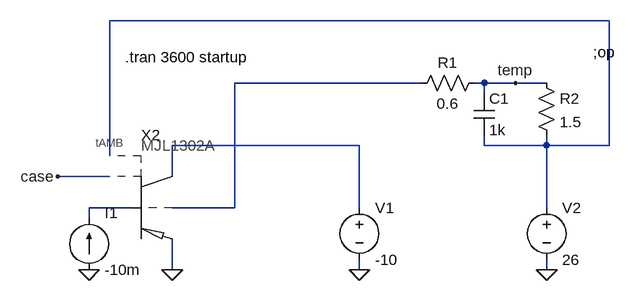
[diagram p0: schematic tb_op.asc]
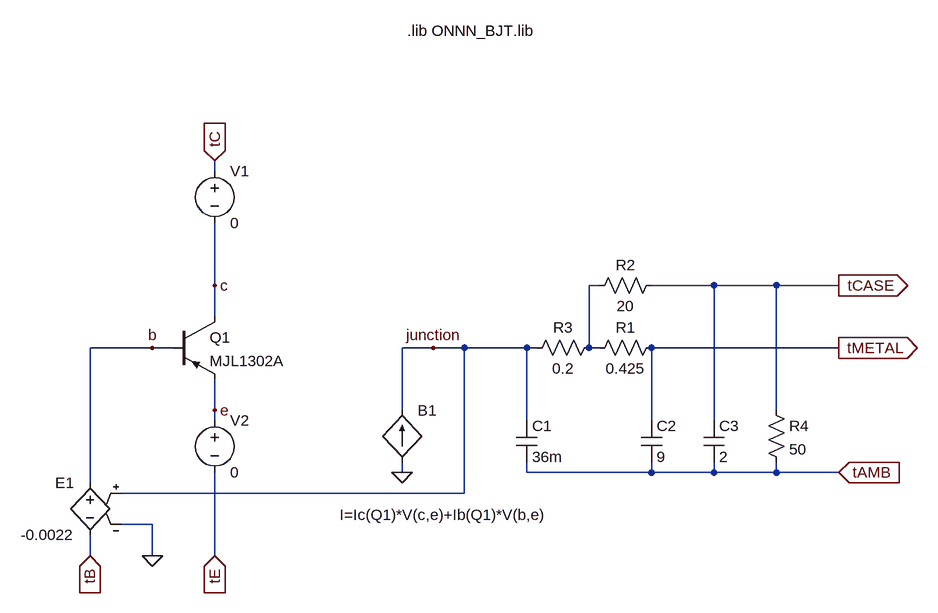
[diagram p1: sub-circuit mjl1302a_therm2p.asc]
tb_op.asc, the LTspice schematic file:
Version 4
SHEET 1 1016 680
WIRE 960 -160 192 -160
WIRE 672 -64 384 -64
WIRE 768 -64 752 -64
WIRE 816 -64 768 -64
WIRE 864 -64 816 -64
WIRE 768 -48 768 -64
WIRE 576 32 288 32
WIRE 768 32 768 16
WIRE 864 32 864 16
WIRE 864 32 768 32
WIRE 960 32 960 -160
WIRE 960 32 864 32
WIRE 192 48 192 -160
WIRE 192 80 112 80
WIRE 288 80 288 32
WIRE 224 128 160 128
WIRE 384 128 384 -64
WIRE 384 128 288 128
WIRE 576 128 576 32
WIRE 864 128 864 32
WIRE 160 144 160 128
WIRE 288 224 288 176
WIRE 576 224 576 208
WIRE 864 224 864 208
FLAG 816 -64 temp
FLAG 576 224 0
FLAG 288 224 0
FLAG 160 224 0
FLAG 864 224 0
FLAG 112 80 case
SYMBOL voltage 576 112 R0
WINDOW 123 0 0 Left 0
WINDOW 39 0 0 Left 0
SYMATTR InstName V1
SYMATTR Value -10
SYMBOL cap 752 -48 R0
SYMATTR InstName C1
SYMATTR Value 1k
SYMBOL res 768 -80 R90
WINDOW 0 0 56 VBottom 0
WINDOW 3 32 56 VTop 0
SYMATTR InstName R1
SYMATTR Value 0.6
SYMBOL res 848 -80 R0
SYMATTR InstName R2
SYMATTR Value 1.5
SYMBOL current 160 224 M180
WINDOW 0 24 88 Left 0
WINDOW 3 24 0 Left 0
WINDOW 123 0 0 Left 0
WINDOW 39 0 0 Left 0
SYMATTR InstName I1
SYMATTR Value -10m
SYMBOL voltage 864 112 R0
WINDOW 123 0 0 Left 0
WINDOW 39 0 0 Left 0
SYMATTR InstName V2
SYMATTR Value 26
SYMBOL MJL1302A_therm2P 272 128 R0
SYMATTR InstName X2
TEXT 936 -112 Left 0 !;op
TEXT 216 -104 Left 0 !.tran 3600 startup

mjl1302a_therm2p.asc, the sub-circuit schematic file:
Version 4
SHEET 1 1244 680
WIRE 128 -240 128 -256
WIRE 128 -64 128 -160
WIRE 720 -64 704 -64
WIRE 896 -64 800 -64
WIRE 992 -64 896 -64
WIRE 1088 -64 992 -64
WIRE 128 -16 128 -64
WIRE 32 32 -64 32
WIRE 64 32 32 32
WIRE 464 32 416 32
WIRE 512 32 464 32
WIRE 608 32 512 32
WIRE 624 32 608 32
WIRE 704 32 704 -64
WIRE 720 32 704 32
WIRE 1088 32 800 32
WIRE 128 128 128 80
WIRE 416 128 416 32
WIRE 992 128 992 -64
WIRE 128 144 128 128
WIRE 608 144 608 32
WIRE 800 144 800 32
WIRE 896 144 896 -64
WIRE 416 224 416 208
WIRE 608 224 608 208
WIRE 800 224 800 208
WIRE 800 224 608 224
WIRE 896 224 896 208
WIRE 896 224 800 224
WIRE 992 224 992 208
WIRE 992 224 896 224
WIRE 1088 224 992 224
WIRE -64 240 -64 32
WIRE 512 256 512 32
WIRE 512 256 -16 256
WIRE 32 304 -16 304
WIRE -64 352 -64 320
WIRE 32 352 32 304
WIRE 128 352 128 224
FLAG 416 224 0
FLAG 128 -64 c
FLAG 32 32 b
FLAG 128 128 e
FLAG 128 -256 tC
IOPIN 128 -256 In
FLAG 464 32 junction
FLAG -64 352 tB
IOPIN -64 352 In
FLAG 32 352 0
FLAG 128 352 tE
IOPIN 128 352 In
FLAG 1088 32 tMETAL
IOPIN 1088 32 Out
FLAG 1088 -64 tCASE
IOPIN 1088 -64 Out
FLAG 1088 224 tAMB
IOPIN 1088 224 In
SYMBOL bi2 416 128 R0
WINDOW 3 -96 161 Left 0
SYMATTR Value I=Ic(Q1)*V(c,e)+Ib(Q1)*V(b,e)
SYMATTR InstName B1
SYMBOL voltage 128 -256 R0
WINDOW 123 0 0 Left 0
WINDOW 39 0 0 Left 0
SYMATTR InstName V1
SYMATTR Value 0
SYMBOL e -64 224 M0
SYMATTR InstName E1
SYMATTR Value -0.0022
SYMBOL voltage 128 128 R0
WINDOW 123 0 0 Left 0
WINDOW 39 0 0 Left 0
SYMATTR InstName V2
SYMATTR Value 0
SYMBOL cap 592 144 R0
SYMATTR InstName C1
SYMATTR Value 36m
SYMBOL res 816 16 R90
WINDOW 0 0 56 VBottom 0
WINDOW 3 32 56 VTop 0
SYMATTR InstName R1
SYMATTR Value 0.425
SYMBOL cap 784 144 R0
SYMATTR InstName C2
SYMATTR Value 9
SYMBOL cap 880 144 R0
SYMATTR InstName C3
SYMATTR Value 2
SYMBOL res 816 -80 R90
WINDOW 0 0 56 VBottom 0
WINDOW 3 32 56 VTop 0
SYMATTR InstName R2
SYMATTR Value 20
SYMBOL res 976 112 R0
SYMATTR InstName R4
SYMATTR Value 50
SYMBOL res 720 16 R90
WINDOW 0 0 56 VBottom 0
WINDOW 3 32 56 VTop 0
SYMATTR InstName R3
SYMATTR Value 0.2
SYMBOL pnp 64 -16 R0
SYMATTR InstName Q1
SYMATTR Value MJL1302A
TEXT 424 -456 Left 0 !.lib ONNN_BJT.lib

The netlist it stands for:
* tb_op.asc
V1 N003 0 -10
C1 temp N001 1k
R1 temp N002 0.6
R2 temp N001 1.5
I1 0 N004 -10m
V2 N001 0 26
XX2 N004 N003 0 N002 case N001 mjl1302a_therm2p

* block symbol definitions
.subckt mjl1302a_therm2p tB tC tE tMETAL tCASE tAMB
B1 0 junction I=Ic(Q1)*V(c,e)+Ib(Q1)*V(b,e)
V1 tC c 0
E1 b tB junction 0 -0.0022
V2 e tE 0
C1 junction tAMB 36m
R1 tMETAL N001 0.425
C2 tMETAL tAMB 9
C3 tCASE tAMB 2
R2 tCASE N001 20
R4 tCASE tAMB 50
R3 N001 junction 0.2
Q1 c b e 0 MJL1302A
.lib ONNN_BJT.lib
.ends mjl1302a_therm2p

.model NPN NPN
.model PNP PNP
.lib standard.bjt
;op
.tran 3600 startup
.backanno
.end